# Altium project FSAE_IMU_TESTBOARD.PrjPcb
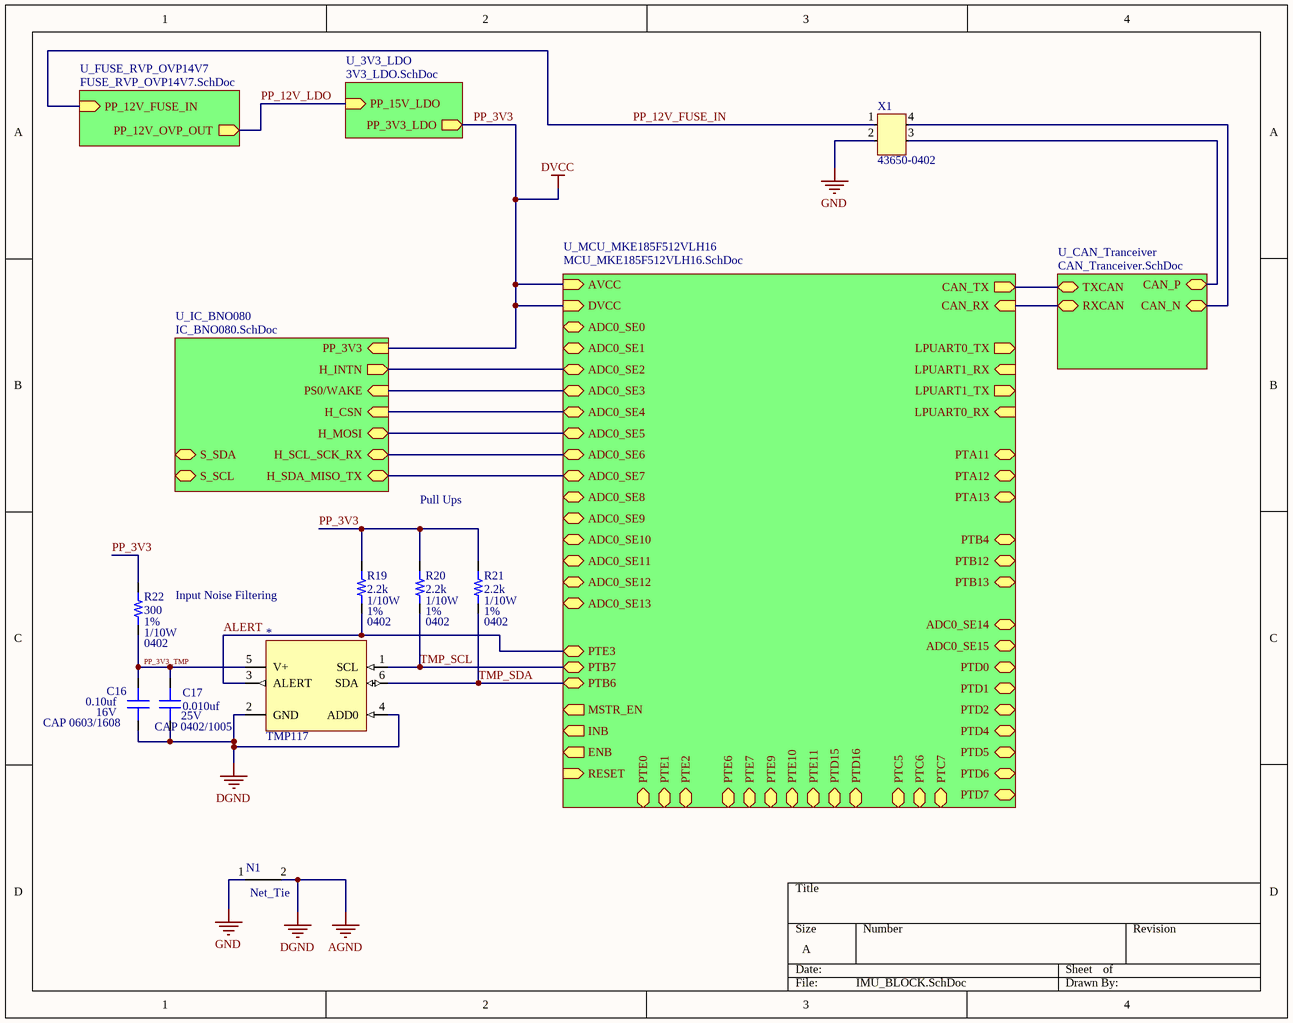
[diagram p0: IMU_BLOCK.SchDoc]
4 sheets, 40 parts. Net scope: hierarchical (ports join the sheet entries above them; power ports are global).
Board file: IMU.PcbDoc
Sheets:
  IMU_BLOCK.SchDoc
    U_FUSE_RVP_OVP14V7 = FUSE_RVP_OVP14V7.SchDoc
    U_3V3_LDO = 3V3_LDO.SchDoc
    U_IC_BNO080 = IC_BNO080.SchDoc

## Sheet IMU_BLOCK.SchDoc
size A

### Parts
(Parts that share a designator on the sheet are numbered #1, #2 ... from top to bottom, then left to right.)
*#1  TMP117  [WSON-6]
C16  value 0.10uf  Voltage_Rating: 16V  [CAP 0603/1608]  (hidden comment: Capacitor MLCC 0.10uf 16V CAP 0603/1608)
C17  value 0.010uf  Voltage_Rating: 25V  [CAP 0402/1005]  (hidden comment: Capacitor MLCC 0.010uf 25V CAP 0402/1005)
N1  Net_Tie  [Net_Tie]
R19  value 2.2k  Tolerance: 1%  Power: 1/10W  Package: 0402  [RES 0402/1005]  (hidden comment: Resistor 2.2k 0402 1/10W 1%)
R20  value 2.2k  Tolerance: 1%  Power: 1/10W  Package: 0402  [RES 0402/1005]  (hidden comment: Resistor 2.2k 0402 1/10W 1%)
R21  value 2.2k  Tolerance: 1%  Power: 1/10W  Package: 0402  [RES 0402/1005]  (hidden comment: Resistor 2.2k 0402 1/10W 1%)
R22  value 300  Tolerance: 1%  Power: 1/10W  Package: 0402  [RES 0402/1005]  (hidden comment: Resistor 300 0402 1/10W 1%)
X1  43650-0402  [Molex_43650_0402]

### Sub-sheets
U_3V3_LDO = 3V3_LDO.SchDoc: PP_3V3_LDO (out), PP_15V_LDO (in)
U_CAN_Tranceiver = CAN_Tranceiver.SchDoc (file not in this document): TXCAN (bidir), RXCAN (bidir), CAN_P (bidir), CAN_N (bidir)
U_FUSE_RVP_OVP14V7 = FUSE_RVP_OVP14V7.SchDoc: PP_12V_FUSE_IN (in), PP_12V_OVP_OUT (out)
U_IC_BNO080 = IC_BNO080.SchDoc: PP_3V3 (in), PS0/WAKE (in), H_SDA_MISO_TX (bidir), H_SCL_SCK_RX (bidir), H_CSN (in), H_MOSI (bidir), S_SDA (bidir), H_INTN (out), S_SCL (bidir)
U_MCU_MKE185F512VLH16 = MCU_MKE185F512VLH16.SchDoc (file not in this document): CAN_TX (out), CAN_RX (in), INB (out), ENB (out), ADC0_SE11 (bidir), ADC0_SE10 (bidir), ADC0_SE9 (bidir), ADC0_SE8 (bidir), ADC0_SE15 (bidir), ADC0_SE14 (bidir), ADC0_SE13 (bidir), ADC0_SE12 (bidir), ADC0_SE7 (bidir), ADC0_SE6 (bidir), ADC0_SE1 (bidir), ADC0_SE0 (bidir), LPUART0_TX (out), LPUART0_RX (in), MSTR_EN (out), ADC0_SE5 (bidir), ADC0_SE4 (bidir), LPUART1_TX (out), LPUART1_RX (in), ADC0_SE3 (bidir), ADC0_SE2 (bidir), DVCC (in), AVCC (in), PTD5 (bidir), PTD6 (bidir), PTD7 (bidir), PTB4 (bidir), PTE9 (bidir), PTD15 (bidir), PTD16 (bidir), PTE3 (bidir), PTB6 (bidir), PTB7 (bidir), PTE10 (bidir), PTE11 (bidir), PTD0 (bidir), PTD1 (bidir), PTC7 (bidir), PTC6 (bidir), PTE6 (bidir), PTE2 (bidir), PTA13 (bidir), PTA12 (bidir), PTA11 (bidir), PTE1 (bidir), PTE0 (bidir), RESET (in), PTD2 (bidir), PTD4 (bidir), PTB13 (bidir), PTB12 (bidir), PTE7 (bidir), PTC5 (bidir)

### Nets
AGND: *#1.2(GND) *#1.4(ADD0) C16.1 C17.1 N1.2  [also labelled DGND]
GND: N1.1 X1.2
PP_3V3: R19.2 R20.2 R21.2 R22.2 ; sheet U_MCU_MKE185F512VLH16/DVCC, sheet U_MCU_MKE185F512VLH16/AVCC, sheet U_3V3_LDO/PP_3V3_LDO, sheet U_IC_BNO080/PP_3V3  [also labelled DVCC]
ALERT: *#1.3(ALERT) R19.1 ; sheet U_MCU_MKE185F512VLH16/PTE3
PP_3V3_TMP: *#1.5(V+) C16.2 C17.2 R22.1
PP_12V_FUSE_IN: X1.1 ; sheet U_FUSE_RVP_OVP14V7/PP_12V_FUSE_IN
PP_12V_LDO: sheet U_FUSE_RVP_OVP14V7/PP_12V_OVP_OUT, sheet U_3V3_LDO/PP_15V_LDO  [project net PP_12V]
TMP_SCL: *#1.1(SCL) R20.1 ; sheet U_MCU_MKE185F512VLH16/PTB7
TMP_SDA: *#1.6(SDA) R21.1 ; sheet U_MCU_MKE185F512VLH16/PTB6
Net*#2_6: sheet U_MCU_MKE185F512VLH16/ADC0_SE3, sheet U_IC_BNO080/PS0/WAKE
Net*#2_14: sheet U_MCU_MKE185F512VLH16/ADC0_SE2, sheet U_IC_BNO080/H_INTN
Net*#2_17: sheet U_MCU_MKE185F512VLH16/ADC0_SE5, sheet U_IC_BNO080/H_MOSI
Net*#2_18: sheet U_MCU_MKE185F512VLH16/ADC0_SE4, sheet U_IC_BNO080/H_CSN
Net*#2_19: sheet U_MCU_MKE185F512VLH16/ADC0_SE6, sheet U_IC_BNO080/H_SCL_SCK_RX
Net*#2_20: sheet U_MCU_MKE185F512VLH16/ADC0_SE7, sheet U_IC_BNO080/H_SDA_MISO_TX
NetX1_3: X1.3 ; sheet U_CAN_Tranceiver/CAN_P
NetX1_4: X1.4 ; sheet U_CAN_Tranceiver/CAN_N
(unnamed): sheet U_CAN_Tranceiver/TXCAN, sheet U_MCU_MKE185F512VLH16/CAN_TX
(unnamed): sheet U_CAN_Tranceiver/RXCAN, sheet U_MCU_MKE185F512VLH16/CAN_RX

### Notes on the sheet
- Pull Ups
- Input Noise Filtering

### Library data of the parts
*#1 = 5: Temperature Sensor Digital, Local -55°C ~ 150°C 16 b 6-WSON (2x2); Manufacturer_id: 1; MfrPartNo: TMP117MAIDRVT; idADC: 5; Created_By: Non Wajanakunakorn; Drawer_id: 1; Package: WSON-6; Link: https://www.digikey.com/product-detail/en/texas-instruments/TMP117MAIDRVT/296-52215-1-ND/9749243
C16 = 223: Manufacturer_id: 1; idCapacitor: 223; Name: Cap_0.10uf_16V_CAP 0603/1608; Dielectric: Ceramic; Created_By: Nick Mah; Drawer_id: 1; Package: CAP 0603/1608; Created_Date: 10/20/2018
C17 = 457: Manufacturer_id: 1; idCapacitor: 457; Name: Cap_0.010uf_25V_CAP 0402/1005; Dielectric: Ceramic; Created_By: Nick Mah; Drawer_id: 1; Package: CAP 0402/1005; Created_Date: 10/20/2018
N1 = 1: Manufacturer_id: 1; idFuse: 3; Name: Net Tie; Drawer_id: 1; idShunt: 1
R19-R21 = 81: Manufacturer_id: 1; idResistor: 81; Name: Res_2.2k_0402_1/10W_1%; Created_By: Nick Mah; Supplier 1: Digi-Key; Drawer_id: 1; ComponentLink1Description: Datasheet; Created_Date: 2018-10-20
R22 = 60: Manufacturer_id: 1; idResistor: 60; Name: Res_300_0402_1/10W_1%; Created_By: Nick Mah; Supplier 1: Digi-Key; Drawer_id: 1; ComponentLink1Description: Datasheet; Created_Date: 2018-10-20
X1 = 6: Manufacturer_id: 4; idConn: 6; Drawer_id: 1; Name: Molex 43650_0402; Value: CONN; Voltage_Rating: 600V; Pitch: 3mm; Created_By: Nick; MfrPartNo: 43650-0402; Num_Contacts: 4; Num_Rows: 1; Package: Conn; Link: https://www.digikey.com/product-detail/en/molex-llc/0436500402/WM11252-ND/3310554; ComponentLink1Description: Datasheet; ComponentLink1URL: https://www.mouser.com/datasheet/2/276/0436500402_PCB_HEADERS-148886.pdf; Supplier1: Digi-Key; Supplier1PartNo: WM11252-ND

## Sheet FUSE_RVP_OVP14V7.SchDoc
size A
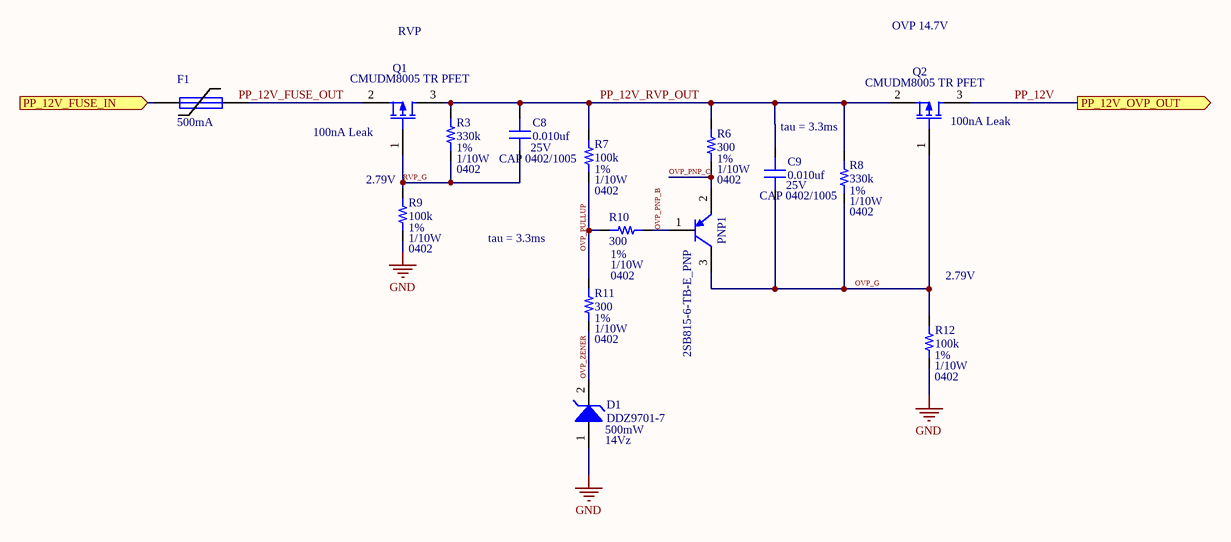
[diagram p1: FUSE_RVP_OVP14V7.SchDoc]

### Parts
C8  value 0.010uf  Voltage_Rating: 25V  [CAP 0402/1005]  (hidden comment: Capacitor MLCC 0.010uf 25V CAP 0402/1005)
C9  value 0.010uf  Voltage_Rating: 25V  [CAP 0402/1005]  (hidden comment: Capacitor MLCC 0.010uf 25V CAP 0402/1005)
D1  DDZ9701-7  value 14Vz  Power: 500mW  [SOD123F]
F1  I_hold: 500mA  [PIN-W2/E2.8]  (hidden comment: 1A)
PNP1  2SB815-6-TB-E_PNP  [SOT23-3]
Q1  CMUDM8005 TR PFET  [CMUDM8005 TR SOT523]
Q2  CMUDM8005 TR PFET  [CMUDM8005 TR SOT523]
R3  value 330k  Tolerance: 1%  Power: 1/10W  Package: 0402  [RES 0402/1005]  (hidden comment: Resistor 330k 0402 1/10W 1%)
R6  value 300  Tolerance: 1%  Power: 1/10W  Package: 0402  [RES 0402/1005]  (hidden comment: Resistor 300 0402 1/10W 1%)
R7  value 100k  Tolerance: 1%  Power: 1/10W  Package: 0402  [RES 0402/1005]  (hidden comment: Resistor 100k 0402 1/10W 1%)
R8  value 330k  Tolerance: 1%  Power: 1/10W  Package: 0402  [RES 0402/1005]  (hidden comment: Resistor 330k 0402 1/10W 1%)
R9  value 100k  Tolerance: 1%  Power: 1/10W  Package: 0402  [RES 0402/1005]  (hidden comment: Resistor 100k 0402 1/10W 1%)
R10  value 300  Tolerance: 1%  Power: 1/10W  Package: 0402  [RES 0402/1005]  (hidden comment: Resistor 300 0402 1/10W 1%)
R11  value 300  Tolerance: 1%  Power: 1/10W  Package: 0402  [RES 0402/1005]  (hidden comment: Resistor 300 0402 1/10W 1%)
R12  value 100k  Tolerance: 1%  Power: 1/10W  Package: 0402  [RES 0402/1005]  (hidden comment: Resistor 100k 0402 1/10W 1%)

### Ports
PP_12V_FUSE_IN (in), PP_12V_OVP_OUT (out)

### Nets
GND: D1.1(A) R9.1 R12.1
OVP_G: C9.1 PNP1.3(C) Q2.1(G) R8.1 R12.2
OVP_PNP_B: PNP1.1(B) R10.1
OVP_PNP_C: PNP1.2(E) R6.1
OVP_PULLUP: R7.1 R10.2 R11.2
OVP_ZENER: D1.2(K) R11.1
PP_12V: Q2.3(D) ; port PP_12V_OVP_OUT
PP_12V_FUSE_IN: F1.1 ; port PP_12V_FUSE_IN
PP_12V_RVP_OUT: C8.2 C9.2 Q1.3(D) Q2.2(S) R3.2 R6.2 R7.2 R8.2
RVP_G: C8.1 Q1.1(G) R3.1 R9.2
NetF1_2: F1.2 Q1.2(S)

### Notes on the sheet
- RVP
- OVP 14.7V
- (near Q1) 100nA Leak
- tau = 3.3ms
- (near Q2) 100nA Leak
- (near R9) 2.79V
- (near R12) 2.79V
- Labels drawn without touching a wire or pin: PP_12V_FUSE_OUT

### Library data of the parts
C8 C9 = 457: as C17 on sheet IMU_BLOCK; Drawer_id: 1; Package: CAP 0402/1005; Created_Date: 10/20/2018
D1 = 10: Zener Diode 14V 500mW ±5% Surface Mount SOD-123; Manufacturer_id: 8; idDiode: 10; Drawer_id: 1; MfrPartNo: DDZ9701-7; Name: DDZ9701; Type: Zener; Num_Circuits: 1; Package: SOD-123; Link: https://www.digikey.com/product-detail/en/diodes-incorporated/DDZ9701-7/DDZ9701-7DICT-ND/3877402; ComponentLink1Description: Datasheet; ComponentLink1URL: https://www.diodes.com/assets/Datasheets/ds30410.pdf; Supplier1: Digi-Key; Supplier1PartNo: DDZ9701-7DICT-ND
F1 = 5: Fuse; Manufacturer_id: 1; MfrPartNo: 1206L050/15YR; idFuse: 5; Name: PTC Poly Fuse Resettable; I_max: 100A; V_max: 15V; Pd_Typ: 600mW; Created_By: Angel; Published: 8-Jun-2000; LatestRevisionDate: 17-Jul-2002; LatestRevisionNote: Re-released for DXP Platform.; PackageReference: PIN-W2/E2.8; Publisher: Altium Limited; PackageDescription: Thru-Hole; 2 Leads; Drawer_id: 1; I_trip: 1A; Link: https://www.digikey.com/product-detail/en/littelfuse-inc/1206L050-15YR/F3733CT-ND/2486168; Created_Date: 10/27/2018
PNP1 = 8: TRANS PNP 15V 0.7A CP; Manufacturer_id: 1; idBJT: 8; Name: 2SB815-6-TB-E PNP; Power: Null; hFE: 200-400; Created_By: None; Drawer_id: 1; Value: 15V 0.7A; Type: PNP; Num_Circuits: 1; Ic: 0.7A; Vce(Max): 15V; Package: SMT 3-CP; MfrPartNo: 2SB815-6-TB-E; Link: https://www.digikey.com/product-detail/en/on-semiconductor/2SB815-6-TB-E/2SB815-6-TB-EOSCT-ND/8538307; ComponentLink1Description: datasheet; ComponentLink1URL: https://www.onsemi.com/pub/Collateral/EN694-D.PDF; Supplier1: Digi-Key; Supplier1PartNo: 2SB815-6-TB-EOSCT-ND; Created_Date: 3/2/2019; Updated_By: Null
Q1 Q2 = 13: MOSFET P-CH 20V 650MA SOT523; Manufacturer_id: 1; idFETs: 13; Value: P_Channel; Rds_On: 360m; Vgs(typ): Null; Vgs(Max): 8V; Power(Max): 300mW; Drawer_id: 1; Name: CMUDM8005 TR PFET; Vdss: 20V; Num_Circuits: 1; Id: 650mA; Package: SOT-523; MfrPartNo: CMUDM8005 TR; Link: https://www.digikey.com/product-detail/en/central-semiconductor-corp/CMUDM8005-TR/CMUDM8005CT-ND/5324590; ComponentLink1Description: datasheet; ComponentLink1URL: https://my.centralsemi.com/get_document.php?cmp=1&mergetype=pd&mergepath=pd&pdf_id=CMUDM8005.PDF; Supplier1: Digi-Key; Supplier1PartNo: CMUDM8005CT-ND; Created_By: Null; Created_Date: 3/2/2019; Updated_By: Null
R3 R8 = 133: Manufacturer_id: 1; idResistor: 133; Name: Res_330k_0402_1/10W_1%; Created_By: Nick Mah; Supplier 1: Digi-Key; Drawer_id: 1; ComponentLink1Description: Datasheet; Created_Date: 2018-10-20
R6 R10 R11 = 60: as R22 on sheet IMU_BLOCK; Supplier 1: Digi-Key; Drawer_id: 1; ComponentLink1Description: Datasheet; Created_Date: 2018-10-20
R7 R9 R12 = 121: Manufacturer_id: 1; idResistor: 121; Name: Res_100k_0402_1/10W_1%; Created_By: Nick Mah; Supplier 1: Digi-Key; Drawer_id: 1; ComponentLink1Description: Datasheet; Created_Date: 2018-10-20

## Sheet 3V3_LDO.SchDoc
size A
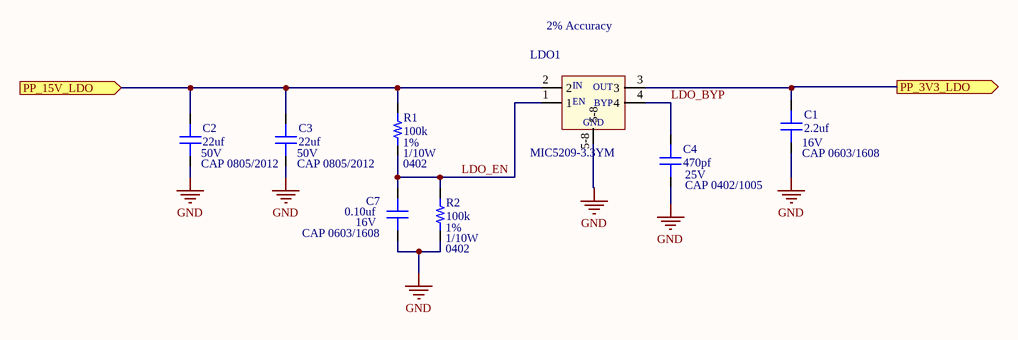
[diagram p2: 3V3_LDO.SchDoc]

### Parts
C1  value 2.2uf  Voltage_Rating: 16V  [CAP 0603/1608]  (hidden comment: Capacitor MLCC 2.2uf 16V CAP 0603/1608)
C2  value 22uf  Voltage_Rating: 50V  [CAP 0805/2012]  (hidden comment: Capacitor MLCC 22uf 50V CAP 0805/2012)
C3  value 22uf  Voltage_Rating: 50V  [CAP 0805/2012]  (hidden comment: Capacitor MLCC 22uf 50V CAP 0805/2012)
C4  value 470pf  Voltage_Rating: 25V  [CAP 0402/1005]  (hidden comment: Capacitor MLCC 470pf 25V CAP 0402/1005)
C7  value 0.10uf  Voltage_Rating: 16V  [CAP 0603/1608]  (hidden comment: Capacitor MLCC 0.10uf 16V CAP 0603/1608)
LDO1  MIC5209-3.3YM  [SOIC-8]
R1  value 100k  Tolerance: 1%  Power: 1/10W  Package: 0402  [RES 0402/1005]  (hidden comment: Resistor 100k 0402 1/10W 1%)
R2  value 100k  Tolerance: 1%  Power: 1/10W  Package: 0402  [RES 0402/1005]  (hidden comment: Resistor 100k 0402 1/10W 1%)

### Ports
PP_3V3_LDO (out), PP_15V_LDO (in)

### Nets
GND: C1.1 C2.1 C3.1 C4.1 C7.1 LDO1.5-8 R2.1
PP_3V3: C1.2 LDO1.3 ; port PP_3V3_LDO
LDO_BYP: C4.2 LDO1.4
LDO_EN: C7.2 LDO1.1 R1.1 R2.2
PP_12V: C2.2 C3.2 LDO1.2 R1.2 ; port PP_15V_LDO

### Notes on the sheet
- 2% Accuracy
- (in symbol 2) OUT; IN; BYP; EN; GND

### Library data of the parts
C1 = 231: Manufacturer_id: 1; idCapacitor: 231; Name: Cap_2.2uf_16V_CAP 0603/1608; Dielectric: Ceramic; Created_By: Nick Mah; Drawer_id: 1; Package: CAP 0603/1608; Created_Date: 10/20/2018
C2 C3 = 1077: Manufacturer_id: 1; idCapacitor: 1077; Name: Cap_22uf_50V_CAP 0805/2012; Dielectric: Ceramic; Created_By: Nick Mah; Drawer_id: 1; Package: CAP 0805/2012; Created_Date: 10/20/2018
C4 = 425: Manufacturer_id: 1; idCapacitor: 425; Name: Cap_470pf_25V_CAP 0402/1005; Dielectric: Ceramic; Created_By: Nick Mah; Drawer_id: 1; Package: CAP 0402/1005; Created_Date: 10/20/2018
C7 = 223: as C16 on sheet IMU_BLOCK; Drawer_id: 1; Package: CAP 0603/1608; Created_Date: 10/20/2018
LDO1 = 2: IC REG LINEAR 3.3V 500MA 8SOIC; Manufacturer_id: 1; MfrPartNo: MIC5209-3.3YM-TRYM; idPMIC_SW: 2; Name: MIC5209-3.3YM 3.3V 500mA LDO; Output_Config: Fixed; Vin(Min): 2.5V; Vin(Max): 16V; Drawer_id: 1; Value: 3.3V 500mA; Num_Outputs: 1; Vout(Min): 3.3v; Vout(Max): 3.3V; Current_Rating: 500mA; Package: SOIC-8; Link: https://www.digikey.com/product-detail/en/microchip-technology/MIC5209-3.3YM-TR/MIC5209-3.3YM-CT-ND/7916551
R1 R2 = 121: as R7 on sheet FUSE_RVP_OVP14V7; Supplier 1: Digi-Key; Drawer_id: 1; ComponentLink1Description: Datasheet; Created_Date: 2018-10-20

## Sheet IC_BNO080.SchDoc
size A
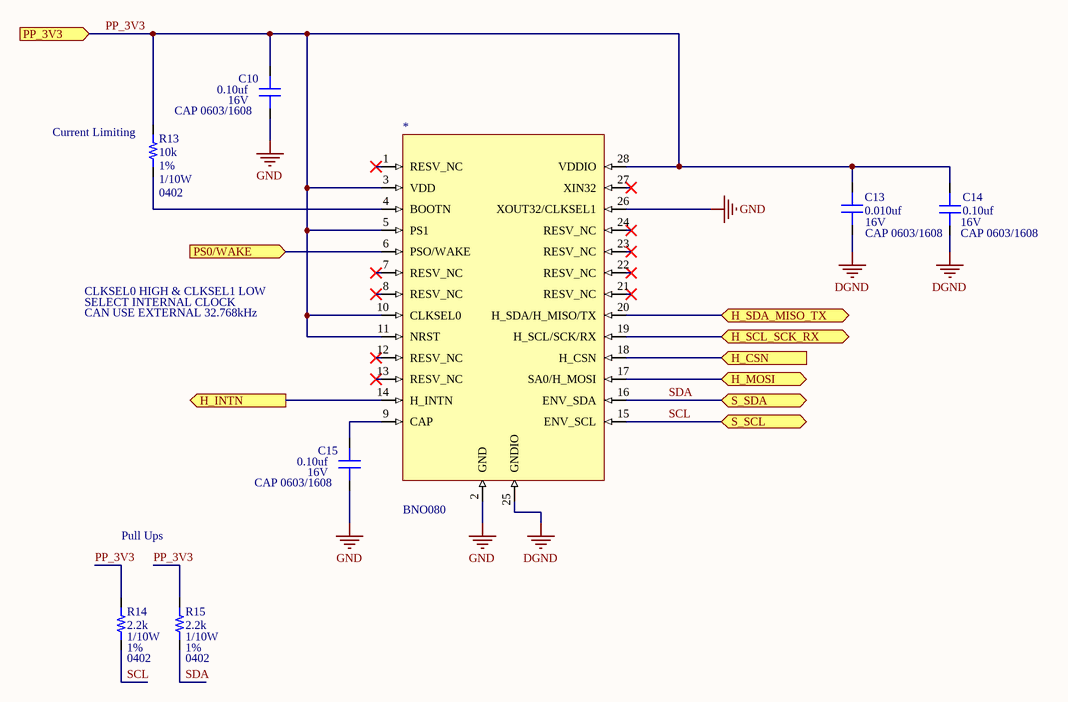
[diagram p3: IC_BNO080.SchDoc]

### Parts
(Parts that share a designator on the sheet are numbered #1, #2 ... from top to bottom, then left to right.)
*#2  BNO080  [BNO080]
C10  value 0.10uf  Voltage_Rating: 16V  [CAP 0603/1608]  (hidden comment: Capacitor MLCC 0.10uf 16V CAP 0603/1608)
C13  value 0.010uf  Voltage_Rating: 16V  [CAP 0603/1608]  (hidden comment: Capacitor MLCC 0.010uf 16V CAP 0603/1608)
C14  value 0.10uf  Voltage_Rating: 16V  [CAP 0603/1608]  (hidden comment: Capacitor MLCC 0.10uf 16V CAP 0603/1608)
C15  value 0.10uf  Voltage_Rating: 16V  [CAP 0603/1608]  (hidden comment: Capacitor MLCC 0.10uf 16V CAP 0603/1608)
R13  value 10k  Tolerance: 1%  Power: 1/10W  Package: 0402  [RES 0402/1005]  (hidden comment: Resistor 10k 0402 1/10W 1%)
R14  value 2.2k  Tolerance: 1%  Power: 1/10W  Package: 0402  [RES 0402/1005]  (hidden comment: Resistor 2.2k 0402 1/10W 1%)
R15  value 2.2k  Tolerance: 1%  Power: 1/10W  Package: 0402  [RES 0402/1005]  (hidden comment: Resistor 2.2k 0402 1/10W 1%)

### Ports
H_CSN (in), H_INTN (out), H_MOSI (bidir), H_SCL_SCK_RX (bidir), H_SDA_MISO_TX (bidir), PP_3V3 (in), PS0/WAKE (in), S_SCL (bidir), S_SDA (bidir)

### Nets
DGND: *#2.25(GNDIO) C13.1 C14.1  [project net AGND]
GND: *#2.2(GND) *#2.26(XOUT32/CLKSEL1) C10.1 C15.1
PP_3V3: *#2.3(VDD) *#2.5(PS1) *#2.10(CLKSEL0) *#2.11(NRST) *#2.28(VDDIO) C10.2 C13.2 C14.2 R13.2 R14.2 R15.2 ; port PP_3V3
SCL: *#2.15(ENV_SCL) R14.1 ; port S_SCL
SDA: *#2.16(ENV_SDA) R15.1 ; port S_SDA
Net*#2_4: *#2.4(BOOTN) R13.1
Net*#2_6: *#2.6(PSO/WAKE) ; port PS0/WAKE
Net*#2_9: *#2.9(CAP) C15.2
Net*#2_14: *#2.14(H_INTN) ; port H_INTN
Net*#2_17: *#2.17(SA0/H_MOSI) ; port H_MOSI
Net*#2_18: *#2.18(H_CSN) ; port H_CSN
Net*#2_19: *#2.19(H_SCL/SCK/RX) ; port H_SCL_SCK_RX
Net*#2_20: *#2.20(H_SDA/H_MISO/TX) ; port H_SDA_MISO_TX

Not connected (* = marked no-connect by the designer): *#2 1(RESV_NC)* 7(RESV_NC)* 8(RESV_NC)* 12(RESV_NC)* 13(RESV_NC)* 21(RESV_NC)* 22(RESV_NC)* 23(RESV_NC)* 24(RESV_NC)* 27(XIN32)*

### Notes on the sheet
- (near R13) Current Limiting
- CLKSEL0 HIGH & CLKSEL1 LOW
- SELECT INTERNAL CLOCK
- CAN USE EXTERNAL 32.768kHz
- Pull Ups

### Library data of the parts
*#2 = 33: Accelerometer, Gyroscope, Magnetometer, 9 Axis Sensor; Manufacturer_id: 1; idIC_Misc: 33; Value: Null; Vin(Min): 1.7V for IO, 2.4V for sensors; Vin(Max): 3.6V; MfrPartNo: BNO080; Drawer_id: 1; Name: BNO080; Type: 9dof IC Sensor; Protocol: Null; Num_Circuits: 1; Data_Rate: Null; Package: 28-TFLGA; ComponentLink1Description: datasheet; ComponentLink1URL: https://cdn.sparkfun.com/assets/1/3/4/5/9/BNO080_Datasheet_v1.3.pdf; Supplier1: Digi-Key; Supplier1PartNo: https://www.digikey.com/product-detail/en/hillcrest-laboratories-inc/BNO080/1888-1000-1-ND/7917169; Created_By: Null; Updated_By: Null
C10 C14 C15 = 223: as C16 on sheet IMU_BLOCK; Drawer_id: 1; Package: CAP 0603/1608; Created_Date: 10/20/2018
C13 = 217: Manufacturer_id: 1; idCapacitor: 217; Name: Cap_0.010uf_16V_CAP 0603/1608; Dielectric: Ceramic; Created_By: Nick Mah; Drawer_id: 1; Package: CAP 0603/1608; Created_Date: 10/20/2018
R13 = 97: Manufacturer_id: 1; idResistor: 97; Name: Res_10k_0402_1/10W_1%; Created_By: Nick Mah; Supplier 1: Digi-Key; Drawer_id: 1; ComponentLink1Description: Datasheet; Created_Date: 2018-10-20
R14 R15 = 81: as R19 on sheet IMU_BLOCK; Supplier 1: Digi-Key; Drawer_id: 1; ComponentLink1Description: Datasheet; Created_Date: 2018-10-20

## Nets that join several sheets
AGND: IMU_BLOCK (5 pins), IC_BNO080 (*#2.25 C13.1 C14.1)
GND: IMU_BLOCK (N1.1 X1.2), FUSE_RVP_OVP14V7 (D1.1 R9.1 R12.1), 3V3_LDO (7 pins), IC_BNO080 (*#2.2 *#2.26 C10.1 C15.1)
PP_3V3: IMU_BLOCK (R19.2 R20.2 R21.2 R22.2), 3V3_LDO (C1.2 LDO1.3), IC_BNO080 (11 pins)
PP_12V: FUSE_RVP_OVP14V7 (Q2.3), 3V3_LDO (C2.2 C3.2 LDO1.2 R1.2)
PP_12V_FUSE_IN: IMU_BLOCK (X1.1), FUSE_RVP_OVP14V7 (F1.1)